# EAGLE design mtch6301 (EAGLE 7.3.0)
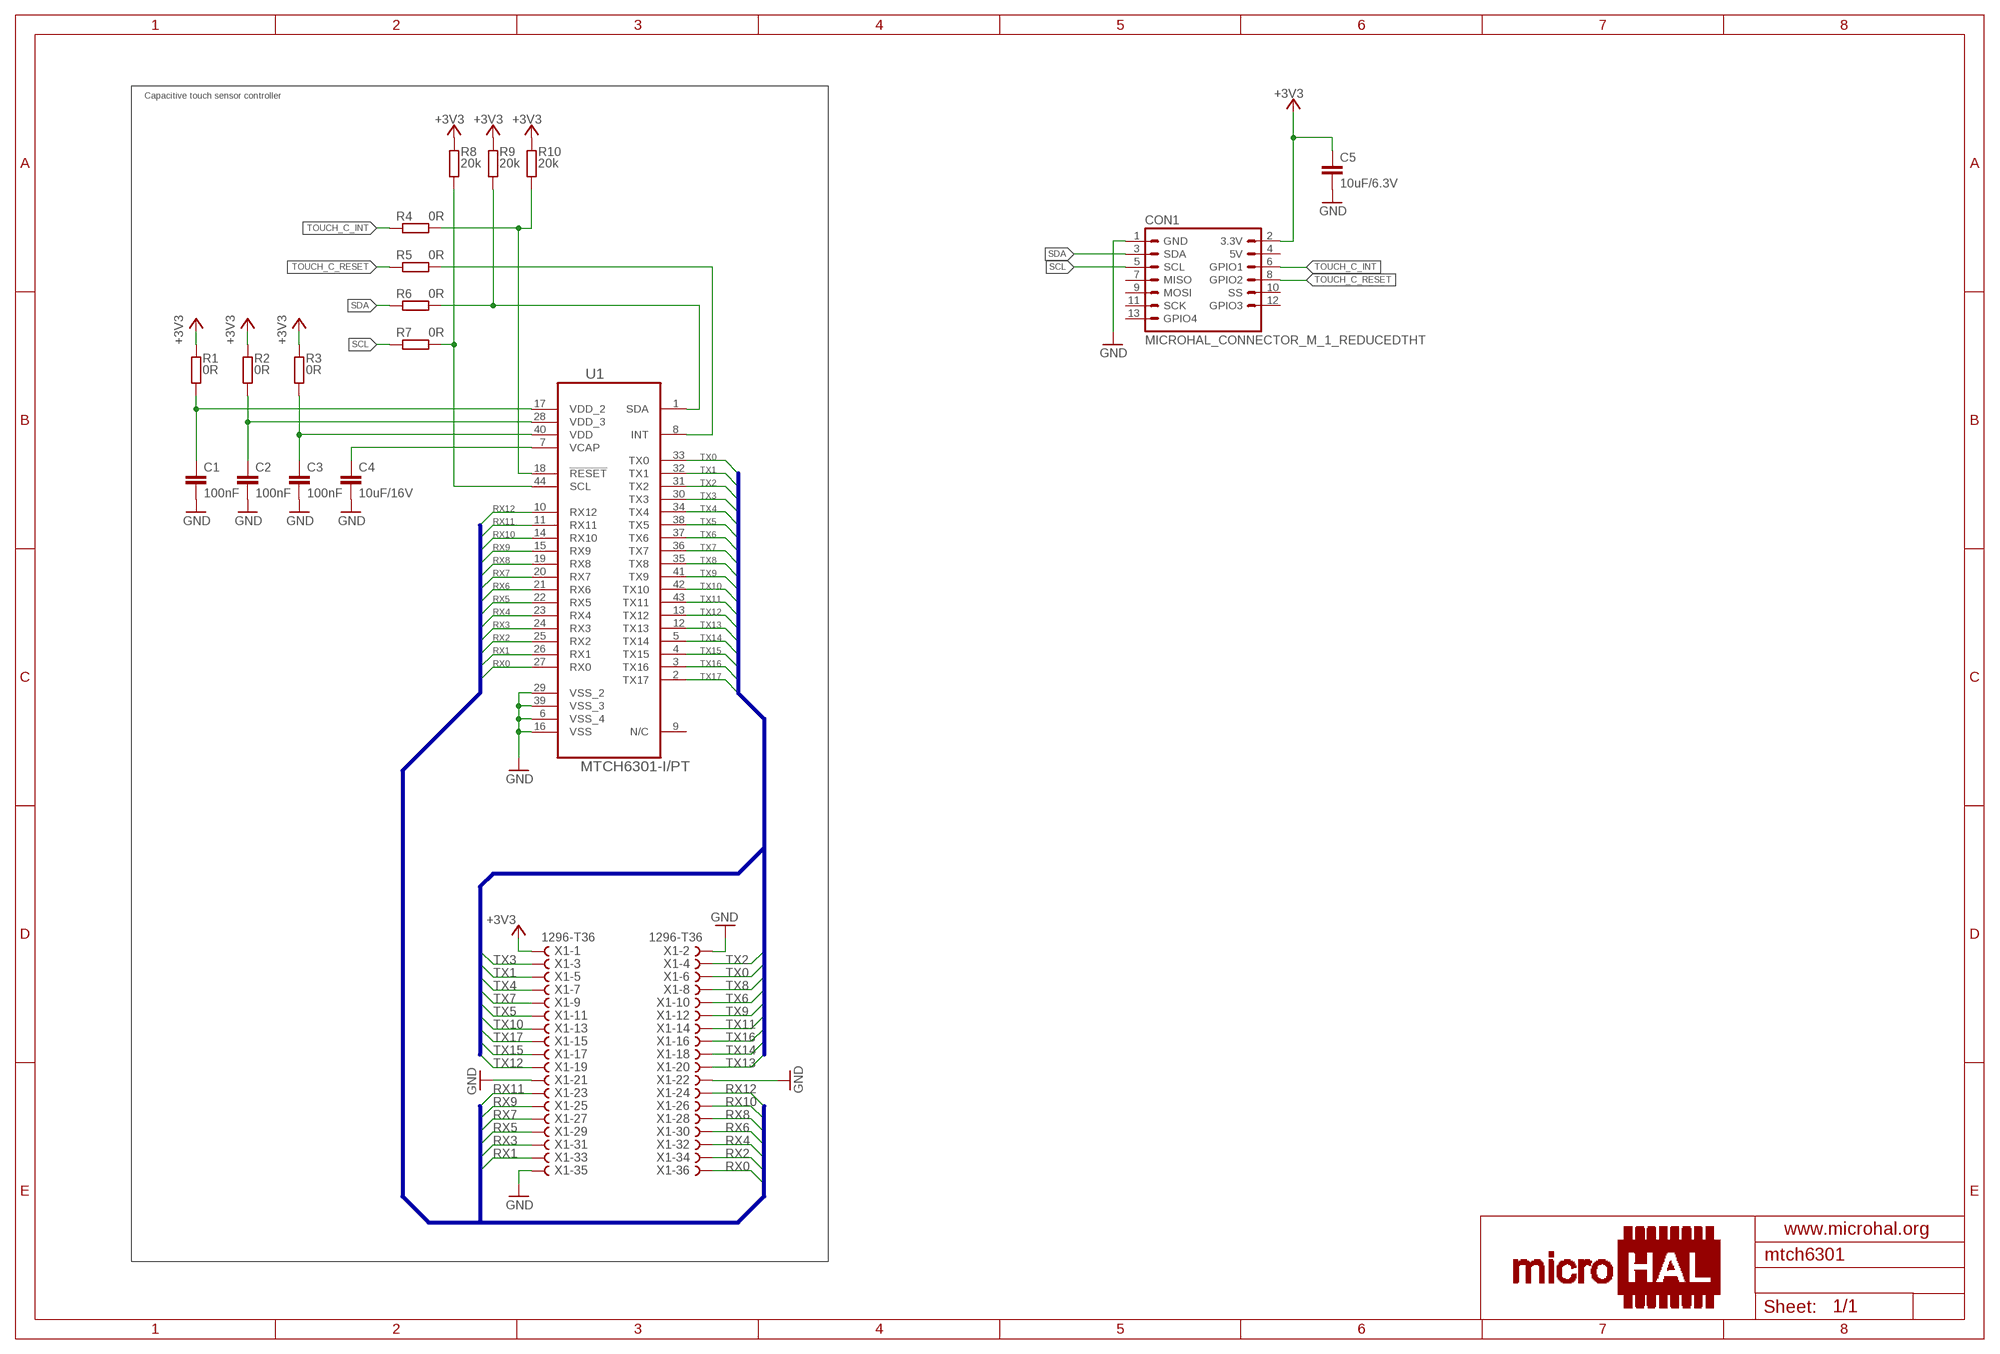
[diagram p0: schematic, sheet 1]

## Parts
C1  100nF  C-EUC0603K  [C0603K]
C2  100nF  C-EUC0603K  [C0603K]
C3  100nF  C-EUC0603K  [C0603K]
C4  10uF/16V  C-EUC1206K  [C1206K]
C5  10uF/6.3V  C-EUC0805K  [C0805K]
CON1  MICROHAL_CONNECTOR_M_1_REDUCEDTHT  [MA07-2]
R1  0R  R-EU_R0603  [R0603]
R2  0R  R-EU_R0603  [R0603]
R3  0R  R-EU_R0603  [R0603]
R4  0R  R-EU_R0603  [R0603]
R5  0R  R-EU_R0603  [R0603]
R6  0R  R-EU_R0603  [R0603]
R7  0R  R-EU_R0603  [R0603]
R8  20k  R-EU_R0603  [R0603]
R9  20k  R-EU_R0603  [R0603]
R10  20k  R-EU_R0603  [R0603]
U1  MTCH6301-I/PT  [TQFP80P1200X1200X120-44N]
X1  1296-T36  [1296-36]

## Nets
+3V3: C5.1 CON1.2(3.3V) R1.1 R2.1 R3.1 R8.1 R9.1 R10.1 X1.1
GND: C1.2 C2.2 C3.2 C4.2 C5.2 CON1.1(GND) U1.6(VSS_4) U1.16(VSS) U1.29(VSS_2) U1.39(VSS_3) X1.2 X1.21 X1.22 X1.35
N$22: C4.1 U1.7(VCAP)
N$24: C3.1 R3.2 U1.40(VDD)
N$25: C2.1 R2.2 U1.28(VDD_3)
N$26: C1.1 R1.2 U1.17(VDD_2)
N$27: R7.1 R8.2 U1.44(SCL)
N$28: R4.1 R10.2 U1.18(!RESET)
N$29: R6.1 R9.2 U1.1(SDA)
N$30: R5.1 U1.8(INT)
RX0: U1.27(RX0) X1.36
RX1: U1.26(RX1) X1.33
RX2: U1.25(RX2) X1.34
RX3: U1.24(RX3) X1.31
RX4: U1.23(RX4) X1.32
RX5: U1.22(RX5) X1.29
RX6: U1.21(RX6) X1.30
RX7: U1.20(RX7) X1.27
RX8: U1.19(RX8) X1.28
RX9: U1.15(RX9) X1.25
RX10: U1.14(RX10) X1.26
RX11: U1.11(RX11) X1.23
RX12: U1.10(RX12) X1.24
SCL: CON1.5(SCL) R7.2
SDA: CON1.3(SDA) R6.2
TOUCH_C_INT: CON1.6(GPIO1) R4.2
TOUCH_C_RESET: CON1.8(GPIO2) R5.2
TX0: U1.33(TX0) X1.6
TX1: U1.32(TX1) X1.5
TX2: U1.31(TX2) X1.4
TX3: U1.30(TX3) X1.3
TX4: U1.34(TX4) X1.7
TX5: U1.38(TX5) X1.11
TX6: U1.37(TX6) X1.10
TX7: U1.36(TX7) X1.9
TX8: U1.35(TX8) X1.8
TX9: U1.41(TX9) X1.12
TX10: U1.42(TX10) X1.13
TX11: U1.43(TX11) X1.14
TX12: U1.13(TX12) X1.19
TX13: U1.12(TX13) X1.20
TX14: U1.5(TX14) X1.18
TX15: U1.4(TX15) X1.17
TX16: U1.3(TX16) X1.16
TX17: U1.2(TX17) X1.15
Unconnected: CON1.4(5V) CON1.7(MISO) CON1.9(MOSI) CON1.10(SS) CON1.11(SCK) CON1.12(GPIO3) CON1.13(GPIO4) U1.9(N/C)

## Buses
RX0,RX1,RX2,RX3,RX4,RX5,RX6,RX7,RX8,RX9,RX10,RX11,RX12
TX0,TX1,TX2,TX3,TX4,TX5,TX6,TX7,TX8,TX9,TX10,TX11,TX12,TX13,TX14,TX15,TX16,TX17

## Notes on the sheet
- Capacitive touch sensor controller

## Library data of the parts
C1-C5 = rcl:C-EU: CAPACITOR, European symbol
CON1 = microhal-connector_v0.1:MICROHAL_CONNECTOR_M_1_REDUCED
R1-R10 = rcl:R-EU_: RESISTOR, European symbol
U1 = mtch6301:MTCH6301-I/PT: IC, TOUCH CTRLR, 44TQFP; MPN: MTCH6301-I/PT; OC_FARNELL: 2301095; OC_NEWARK: 69W0668; PACKAGE: 44TQFP; SUPPLIER: Microchip
X1 = con-leotronics:1296-T36: 1.27mm SINGLE ROW FEMALE SOCKET Source: http://www.leotronics.co.uk/Conexcon/Data%20Sheets/sec.%20A/1296ing.pdf; OC_FARNELL: unknown; OC_NEWARK: unknown

## Board
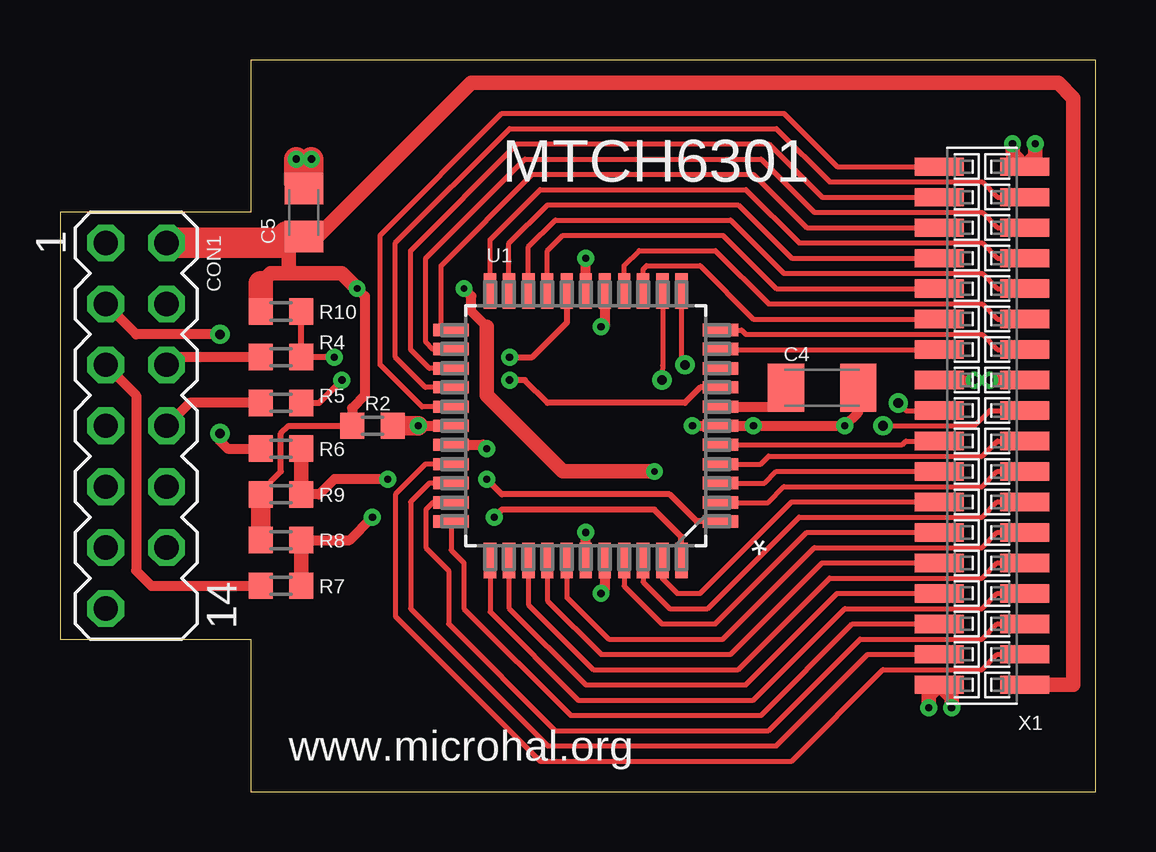
[diagram p1: board, top side]
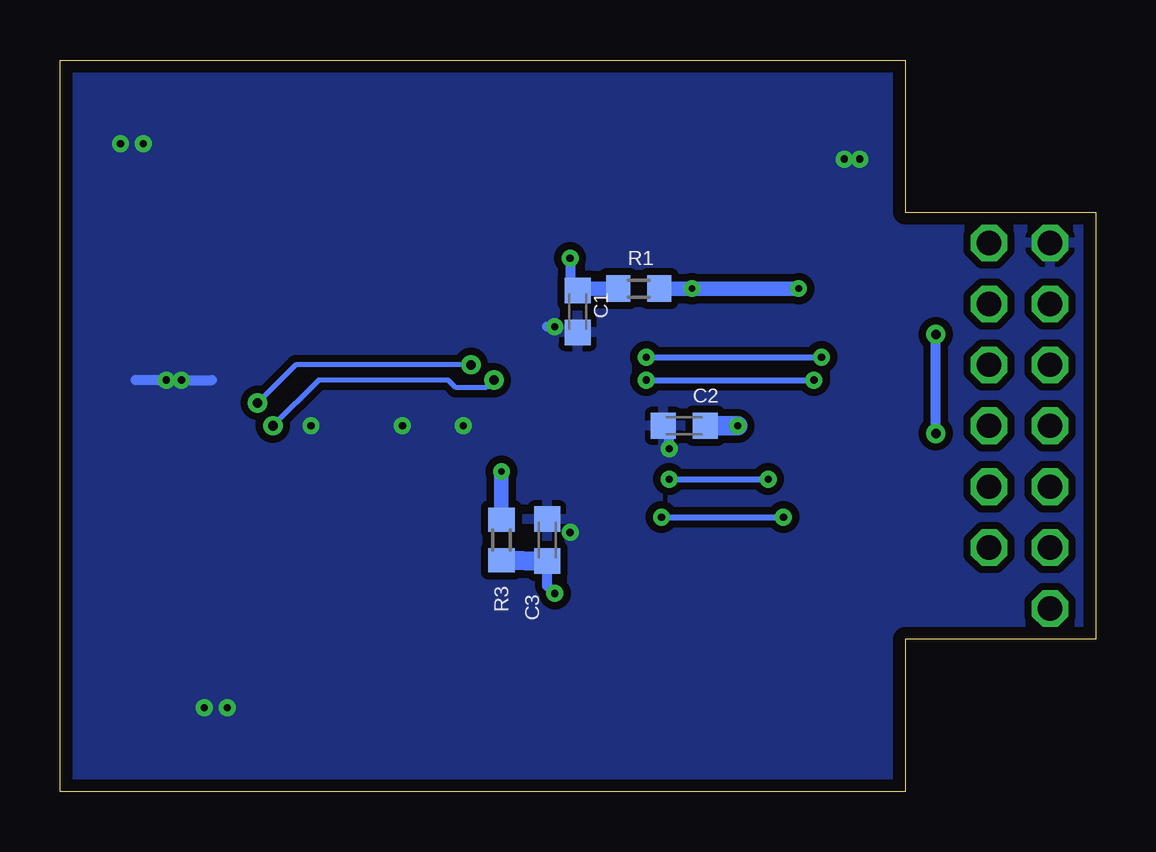
[diagram p2: board, bottom side, seen from below]

Size 43.16 x 30.48 mm. Coordinates in mm from the lower left corner, seen from the top.
Outline: 0,6.35 7.94,6.35 7.94,0 43.16,0 43.16,30.48 7.94,30.48 7.94,24.13 0,24.13 0,6.35
Copper layers (1*16): Top 0.035mm / dielectric 1.5mm / Bottom 0.035mm
Design rules "default *": minimum track width 8mil, minimum drill 11mil, track to track 8mil, track to pad 6mil, pad to pad 8mil, via to via 8mil, smd to smd 8mil, copper to edge 20mil, drill to drill 8mil, minimum pad ring 10mil, minimum via ring 8mil, stop-mask expansion 4mil, vias tented up to drill 16mil, thermal gap 10mil

### Footprints (pad centres in the part's own frame; a part is rotated, then mirrored left to right if it is on the bottom)
C0603K = smd 1.05 x 1.08: 1 -0.875,0; 2 0.875,0
C1206K = smd 1.5 x 2: 1 -1.5,0; 2 1.5,0
C0805K = smd 1.3 x 1.6: 1 -1,0; 2 1,0
MA07-2 = drill 1.016 octagon: 1 -7.62,-1.27; 2 -7.62,1.27; 3 -5.08,-1.27; 4 -5.08,1.27; 5 -2.54,-1.27; 6 -2.54,1.27; 7 0,-1.27; 8 0,1.27; 9 2.54,-1.27; 10 2.54,1.27; 11 5.08,-1.27; 12 5.08,1.27; 13 7.62,-1.27
R0603 = smd 1 x 1.1: 1 -0.85,0; 2 0.85,0
TQFP80P1200X1200X120-44N = smd 1.473 x 0.508: 1 -5.613,3.988; 2 -5.613,3.2; 3 -5.613,2.388; 4 -5.613,1.6; 5 -5.613,0.787; 6 -5.613,0; 7 -5.613,-0.787; 8 -5.613,-1.6; 9 -5.613,-2.388; 10 -5.613,-3.2; 11 -5.613,-3.988; 23 5.613,-3.988; 24 5.613,-3.2; 25 5.613,-2.388; 26 5.613,-1.6; 27 5.613,-0.787; 28 5.613,0; 29 5.613,0.787; 30 5.613,1.6; 31 5.613,2.388; 32 5.613,3.2; 33 5.613,3.988 | smd 0.508 x 1.473: 12 -3.988,-5.613; 13 -3.2,-5.613; 14 -2.388,-5.613; 15 -1.6,-5.613; 16 -0.787,-5.613; 17 0,-5.613; 18 0.787,-5.613; 19 1.6,-5.613; 20 2.388,-5.613; 21 3.2,-5.613; 22 3.988,-5.613; 34 3.988,5.613; 35 3.2,5.613; 36 2.388,5.613; 37 1.6,5.613; 38 0.787,5.613; 39 0,5.613; 40 -0.787,5.613; 41 -1.6,5.613; 42 -2.388,5.613; 43 -3.2,5.613; 44 -3.988,5.613
1296-36 = smd 0.76 x 2.05: 1 -10.795,-1.78; 2 -10.795,1.78; 3 -9.525,-1.78; 4 -9.525,1.78; 5 -8.255,-1.78; 6 -8.255,1.78; 7 -6.985,-1.78; 8 -6.985,1.78; 9 -5.715,-1.78; 10 -5.715,1.78; 11 -4.445,-1.78; 12 -4.445,1.78; 13 -3.175,-1.78; 14 -3.175,1.78; 15 -1.905,-1.78; 16 -1.905,1.78; 17 -0.635,-1.78; 18 -0.635,1.78; 19 0.635,-1.78; 20 0.635,1.78; 21 1.905,-1.78; 22 1.905,1.78; 23 3.175,-1.78; 24 3.175,1.78; 25 4.445,-1.78; 26 4.445,1.78; 27 5.715,-1.78; 28 5.715,1.78; 29 6.985,-1.78; 30 6.985,1.78; 31 8.255,-1.78; 32 8.255,1.78; 33 9.525,-1.78; 34 9.525,1.78; 35 10.795,-1.78; 36 10.795,1.78

### Placement (x,y rotation side)
C1  21.59,20 270 bottom
C2  17.14,15.24 180 bottom
C3  22.86,10.48 90 bottom
C4  31.75,16.83 0 top
C5  10.16,24.13 90 top
CON1  3.17,15.24 270 top
R1  19.05,20.95 180 bottom
R2  13.02,15.24 0 top
R3  24.76,10.48 270 bottom
R4  9.21,18.1 180 top
R5  9.21,16.19 180 top
R6  9.21,14.29 180 top
R7  9.21,8.57 180 top
R8  9.21,10.48 0 top
R9  9.21,12.38 0 top
R10  9.21,20 0 top
U1  21.91,15.24 180 top
X1  38.42,15.24 90 top

### Tracks (layer width: path | path; a pad name or v marks a point on that pad's centre or on a via)
+3V3  (via drill 0.28)
  Top 0.254: R9.1 8.36,12.48 9.21,13.34 9.21,14.92 9.53,15.24 R2.1
  Top 0.406: 17.78,19.37 17.14,20 17.14,20.64 v16.83,20.95 | v12.38,20.95 12.7,20.64 12.7,16.51 12.17,15.98 R2.1
  Top 0.61: v12.38,20.95 11.75,21.59 9.53,21.59 | v24.76,13.34 20.95,13.34 17.78,16.51 17.78,19.37 | X1.1 42.23,4.45 42.23,28.89 41.59,29.53 17.14,29.53 10.75,23.13 C5.1 | 8.26,20.11 R10.1 | 9.53,21.59 8.78,21.59 8.36,21.17 | 9.21,22.86 9.53,22.54 9.53,21.59
  Top 0.813: R8.1 R9.1
  Top 1.016: 8.36,21.17 R10.1
  Top 1.27: CON1.2 9.21,22.86 9.48,23.13 C5.1
  Bottom 0.61: R1.1 v16.83,20.95 v12.38,20.95 | R3.1 v24.76,13.34
GND  (via drill 0.3)
  Top 0.406: U1.6 v32.7,15.24 33.25,15.79 C4.2 | U1.29 17.61,14.45 v17.78,14.29 | U1.39 v21.91,10.79 | X1.22 v38.1,17.14 | X1.21 v38.73,17.14 | v26.35,15.24 26.99,15.24 | U1.16 22.69,19.37 v22.54,19.37
  Top 0.61: v36.2,3.49 36.2,4 X1.2 37.15,3.94 v37.15,3.49 | v40.64,26.99 40.64,26.48 X1.35 39.69,26.55 v39.69,26.99
  Top 1.016: v10.48,26.35 10.48,25.45 arc-90 C5.2 | v9.84,26.35 9.84,25.4 arc90 10.16,25.08
  Bottom 0.406: v17.78,14.29 17.78,14.85 C2.2 | v38.1,17.14 36.83,17.14 | v38.73,17.14 40.01,17.14 | v22.54,19.37 22.86,19.37
  other vias: 28.89,15.24
  pour Bottom (isolate 0.305): -2.22,30.48 43.5,30.48 43.5,0 -2.22,0
N$22
  Top 0.406: U1.7 30.25,16.03 C4.1
N$24  (via drill 0.3)
  Top 0.406: U1.40 22.69,8.41 v22.54,8.26
  Bottom 0.406: v22.54,8.26 22.86,8.57 C3.1
  Bottom 0.813: R3.2 C3.1
N$25  (via drill 0.3)
  Top 0.406: v14.92,15.24 U1.28
  Top 0.813: R2.2 v14.92,15.24
  Bottom 0.406: C2.1 v14.92,15.24
  Bottom 0.813: U1.28 v14.92,15.24
N$26  (via drill 0.3)
  Top 0.406: U1.17 v21.91,22.23
  Bottom 0.406: v21.91,22.23 21.91,20.88 C1.1
  Bottom 0.61: R1.2 21.51,20.95 C1.1
N$27  (via drill 0.3)
  Top 0.254: U1.44 25.89,10.62 24.76,11.75 18.41,11.75 v18.1,11.43
  Top 0.406: R8.2 12.06,10.48 v13.02,11.43
  Top 0.61: R8.2 R7.1
  Bottom 0.254: v18.1,11.43 v13.02,11.43
N$28  (via drill 0.3)
  Top 0.254: R10.2 R4.1 v11.43,18.1 | U1.18 21.12,19.53 19.68,18.1 v18.73,18.1
  Bottom 0.254: v18.73,18.1 v11.43,18.1
N$29  (via drill 0.3)
  Top 0.254: U1.1 26.53,11.25 25.4,12.38 18.41,12.38 v17.78,13.02
  Top 0.406: v13.65,13.02 11.43,13.02 10.79,12.38 R9.2
  Top 0.61: R6.1 R9.2
  Bottom 0.254: v17.78,13.02 v13.65,13.02
N$30  (via drill 0.3)
  Top 0.254: U1.8 26.68,16.84 26.04,16.19 20.32,16.19 19.37,17.14 v18.73,17.14 | R5.1 10.79,16.19 v11.75,17.14
  Bottom 0.254: v18.73,17.14 v11.75,17.14
RX0
  Top 0.203: U1.27 15.09,16.03 13.34,17.78 13.34,23.18 18.41,28.26 30.16,28.26 32.39,26.04 X1.36
RX1
  Top 0.203: U1.26 15.23,16.84 13.97,18.1 13.97,22.86 18.73,27.62 29.84,27.62 32.07,25.4 38.42,25.4 39.05,24.77 X1.33
RX2
  Top 0.203: U1.25 15.39,17.63 14.61,18.41 14.61,22.54 19.05,26.99 29.53,26.99 31.75,24.77 X1.34
RX3
  Top 0.203: U1.24 15.58,18.44 15.56,18.41 15.24,18.73 15.24,22.23 19.37,26.35 29.21,26.35 31.43,24.13 38.42,24.13 39.05,23.5 X1.31
RX4
  Top 0.203: U1.23 15.88,19.23 15.88,21.91 19.68,25.72 28.89,25.72 31.11,23.5 X1.32
RX5
  Top 0.203: U1.22 17.92,23 20,25.08 28.57,25.08 30.8,22.86 38.42,22.86 39.05,22.23 X1.29
RX6
  Top 0.203: U1.21 18.71,22.84 20.32,24.45 28.26,24.45 30.48,22.23 X1.30
RX7
  Top 0.203: U1.20 19.52,22.7 20.64,23.81 27.94,23.81 30.16,21.59 38.42,21.59 39.05,20.95 X1.27
RX8
  Top 0.203: U1.19 20.31,22.53 20.95,23.18 27.62,23.18 29.84,20.95 X1.28
RX9
  Top 0.203: U1.15 23.51,21.92 24.13,22.54 27.3,22.54 29.53,20.32 38.42,20.32 39.05,19.68 X1.25
RX10
  Top 0.203: U1.14 24.29,21.75 24.45,21.91 26.67,21.91 28.89,19.68 X1.26
RX11
  Top 0.203: U1.11 28.4,19.23 28.57,19.05 38.42,19.05 39.05,18.41 X1.23
RX12
  Top 0.203: U1.10 27.55,18.41 X1.24
SCL
  Top 0.406: CON1.5 3.17,16.51 3.17,9.21 3.81,8.57 R7.2
SDA  (via drill 0.4)
  Top 0.406: CON1.3 3.17,19.05 v6.67,19.05 | R6.2 6.99,14.29 6.67,14.61 v6.67,14.92
  Bottom 0.406: v6.67,14.92 v6.67,19.05
TOUCH_C_INT
  Top 0.406: R4.2 4.76,18.1 CON1.6
TOUCH_C_RESET
  Top 0.406: R5.2 5.4,16.19 CON1.8
TX0
  Top 0.203: U1.33 16.29,10.06 16.83,9.53 16.83,7.62 21.27,3.17 29.21,3.17 33.02,6.99 X1.6
TX1
  Top 0.203: U1.32 15.53,12.04 15.24,11.75 15.24,10.16 16.19,9.21 16.19,6.99 20.64,2.54 29.53,2.54 33.34,6.35 38.42,6.35 39.05,6.99 X1.5
TX2
  Top 0.203: U1.31 15.39,12.85 14.61,12.06 14.61,7.62 20.32,1.91 29.84,1.91 33.66,5.71 X1.4
TX3
  Top 0.203: U1.30 15.23,13.64 13.97,12.38 13.97,7.3 20,1.27 30.48,1.27 34.29,5.08 38.42,5.08 39.05,5.71 X1.3
TX4
  Top 0.203: U1.34 17.92,7.48 21.59,3.81 28.89,3.81 32.7,7.62 38.42,7.62 39.05,8.26 X1.7
TX5
  Top 0.203: U1.38 21.12,8.09 22.86,6.35 27.62,6.35 31.43,10.16 38.42,10.16 39.05,10.79 X1.11
TX6
  Top 0.203: U1.37 20.31,7.95 22.54,5.71 27.94,5.71 31.75,9.53 X1.10
TX7
  Top 0.203: U1.36 19.52,7.79 22.22,5.08 28.26,5.08 32.07,8.89 38.42,8.89 39.05,9.53 X1.9
TX8
  Top 0.203: U1.35 18.71,7.64 21.91,4.45 28.57,4.45 32.39,8.26 X1.8
TX9
  Top 0.203: U1.41 23.51,8.56 25.08,6.99 27.3,6.99 31.11,10.79 X1.12
TX10
  Top 0.203: U1.42 24.29,8.72 25.4,7.62 26.99,7.62 30.8,11.43 38.42,11.43 39.05,12.06 X1.13
TX11
  Top 0.203: U1.43 25.11,8.87 25.72,8.26 26.67,8.26 30.48,12.06 X1.14
TX12  (via drill 0.4)
  Top 0.203: U1.13 25.11,17.75 v25.08,17.14 | v34.29,15.24 38.1,15.24 38.73,15.88 X1.19
  Bottom 0.203: v25.08,17.14 25.4,16.83 26.67,16.83 26.99,17.14 32.39,17.14 v34.29,15.24
TX13  (via drill 0.4)
  Top 0.203: U1.12 25.89,17.92 v26.04,17.78 | v34.93,16.19 35.24,15.88 X1.20
  Bottom 0.203: v26.04,17.78 33.34,17.78 v34.93,16.19
TX14
  Top 0.203: U1.5 35.09,14.45 35.24,14.61 X1.18
TX15
  Top 0.203: U1.4 29.2,13.64 29.53,13.97 38.42,13.97 39.05,14.61 X1.17
TX16
  Top 0.203: U1.3 29.36,12.85 29.84,13.34 X1.16
TX17
  Top 0.203: U1.2 29.5,12.04 30.16,12.7 38.42,12.7 39.05,13.34 X1.15

### Text on the board
tPlace: MTCH6301 | www.microhal.org